# Altium schematic sheet GTM_Logic.SchDoc
size A4
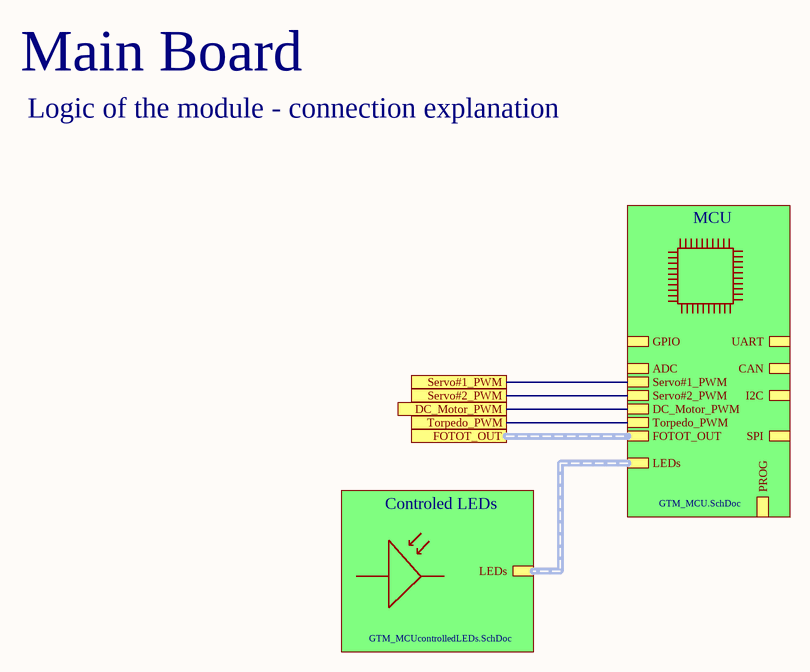
[diagram p0: GTM_Logic.SchDoc]

## Sub-sheets
Controled LEDs = GTM_MCUcontrolledLEDs.SchDoc: LEDs
MCU = GTM_MCU.SchDoc: ADC, GPIO, UART, CAN, I2C, SPI, PROG, LEDs, Servo#1_PWM, Servo#2_PWM, DC_Motor_PWM, Torpedo_PWM, FOTOT_OUT

## Ports
DC_Motor_PWM, FOTOT_OUT, Servo#1_PWM, Servo#2_PWM, Torpedo_PWM

## Nets
DC_Motor_PWM: port DC_Motor_PWM, sheet MCU/DC_Motor_PWM
Servo#1_PWM: port Servo#1_PWM, sheet MCU/Servo#1_PWM
Servo#2_PWM: port Servo#2_PWM, sheet MCU/Servo#2_PWM
Torpedo_PWM: port Torpedo_PWM, sheet MCU/Torpedo_PWM

## Buses and harness runs
harness port FOTOT_OUT = sheet MCU/FOTOT_OUT
harness sheet Controled LEDs/LEDs = sheet MCU/LEDs

## Notes on the sheet
- Main Board
- Logic of the module - connection explanation